# EAGLE design VisualightMicroBulb_041 (EAGLE 6.2)
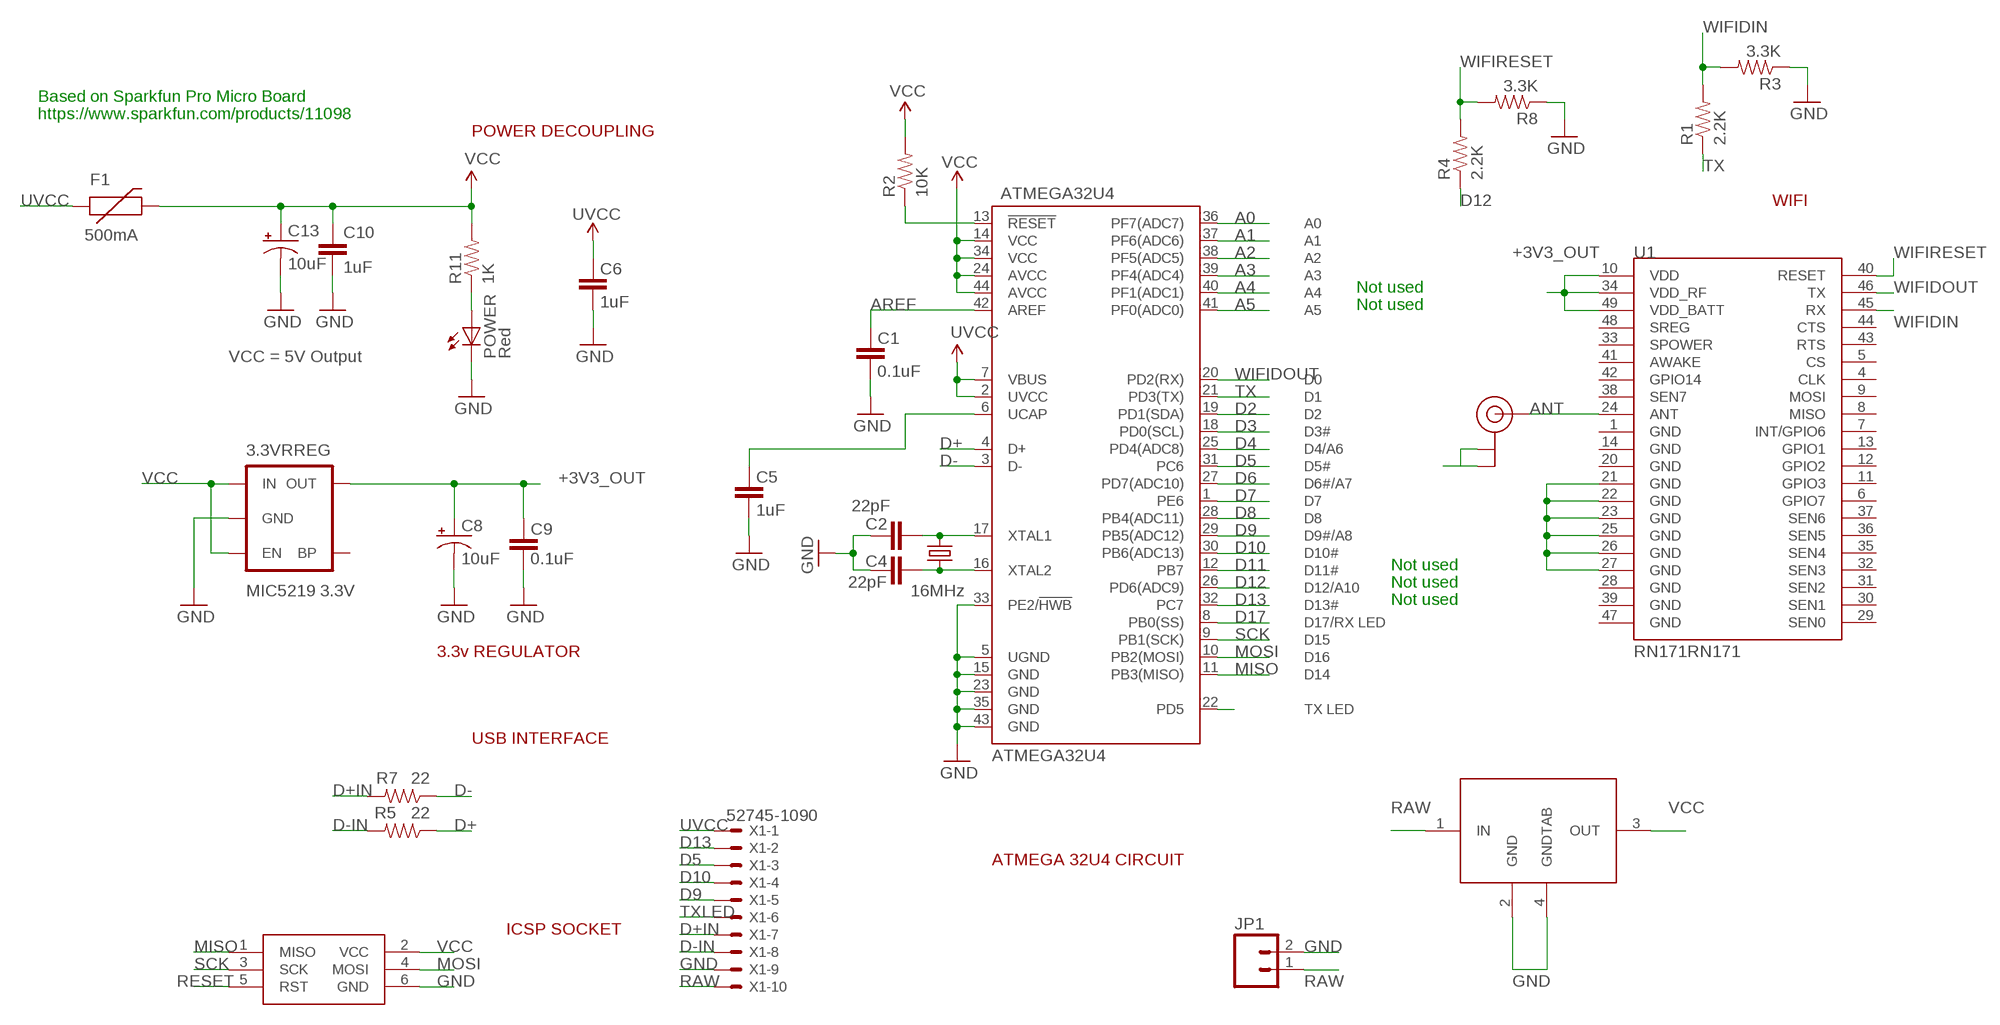
[diagram p0: schematic, sheet 1]

## Parts
3.3VRREG  MIC5219 3.3V  V_REG_MIC52193.3V  [SOT23-5]
ATMEGA32U4  ATMEGA32U4  ATMEGA32U4TQFP  [SPARKFUN-DIGITALIC_TQFP44]
C1  0.1uF  CAP0402-CAP  [0402-CAP]
C2  22pF  CAP0402-CAP  [0402-CAP]
C4  22pF  CAP0402-CAP  [0402-CAP]
C5  1uF  CAP0402-CAP  [0402-CAP]
C6  1uF  CAP0402-CAP  [0402-CAP]
C8  10uF  CAP_POL1206  [EIA3216]
C9  0.1uF  CAP0402-CAP  [0402-CAP]
C10  1uF  CAP0402-CAP  [0402-CAP]
C13  10uF  CAP_POL1206  [EIA3216]
F1  500mA  PTCSMD  [PTC-1206]
ISP1  AVRISP-6  [AVRISP]
JP1  M02PTH  [1X02]
POWER  Red  LED0603  [LED-0603]
R1  2.2K  RESISTOR0402-RES  [0402-RES]
R2  10K  RESISTOR0402-RES  [0402-RES]
R3  3.3K  RESISTOR0402-RES  [0402-RES]
R4  2.2K  RESISTOR0402-RES  [0402-RES]
R5  22  RESISTOR0402-RES  [0402-RES]
R7  22  RESISTOR0402-RES  [0402-RES]
R8  3.3K  RESISTOR0402-RES  [0402-RES]
R11  1K  RESISTOR0402-RES  [0402-RES]
U1  RN171RN171  [RN171]
U$1  U.FL  [U.FL]
U$2  MIC5239  [SOT223]
X1  52745-1090  [52745-1090]
Y1  16MHz  CRYSTAL5X3  [CRYSTAL-SMD-5X3]

## Nets
+3V3_OUT: 3.3VRREG.5(OUT) C8.A(+) C9.2 U1.10(VDD) U1.34(VDD_RF) U1.49(VDD_BATT)
A0: ATMEGA32U4.36(PF7(ADC7))
A1: ATMEGA32U4.37(PF6(ADC6))
A2: ATMEGA32U4.38(PF5(ADC5))
A3: ATMEGA32U4.39(PF4(ADC4))
A4: ATMEGA32U4.40(PF1(ADC1))
A5: ATMEGA32U4.41(PF0(ADC0))
ANT: U1.24(ANT) U$1.P$3(SIGNAL)
AREF: ATMEGA32U4.42(AREF) C1.2
D2: ATMEGA32U4.19(PD1(SDA))
D3: ATMEGA32U4.18(PD0(SCL))
D4: ATMEGA32U4.25(PD4(ADC8))
D5: ATMEGA32U4.31(PC6) X1.3
D6: ATMEGA32U4.27(PD7(ADC10))
D7: ATMEGA32U4.1(PE6)
D8: ATMEGA32U4.28(PB4(ADC11))
D9: ATMEGA32U4.29(PB5(ADC12)) X1.5
D10: ATMEGA32U4.30(PB6(ADC13)) X1.4
D11: ATMEGA32U4.12(PB7)
D12: ATMEGA32U4.26(PD6(ADC9)) R4.1
D13: ATMEGA32U4.32(PC7) X1.2
D17: ATMEGA32U4.8(PB0(SS))
D+: ATMEGA32U4.4(D+) R5.1
D+IN: R7.2 X1.7
D-: ATMEGA32U4.3(D-) R7.1
D-IN: R5.2 X1.8
GND [vcc]: 3.3VRREG.2(GND) ATMEGA32U4.5(UGND) ATMEGA32U4.15(GND) ATMEGA32U4.23(GND) ATMEGA32U4.33(PE2/!HWB) ATMEGA32U4.35(GND) ATMEGA32U4.43(GND) C1.1 C2.2 C4.2 C5.1 C6.1 C8.C(-) C9.1 C10.2 C13.C(-) ISP1.6(GND) JP1.2 POWER.C R3.1 R8.1 U1.21(GND) U1.22(GND) U1.23(GND) U1.25(GND) U1.26(GND) U1.27(GND) U$1.P$1(GND) U$1.P$2(GND) U$2.2(GND) U$2.4(GNDTAB) X1.9
MISO: ATMEGA32U4.11(PB3(MISO)) ISP1.1(MISO)
MOSI: ATMEGA32U4.10(PB2(MOSI)) ISP1.4(MOSI)
N$1: ATMEGA32U4.16(XTAL2) C4.1 Y1.1
N$2: ATMEGA32U4.17(XTAL1) C2.1 Y1.3
N$4: ATMEGA32U4.6(UCAP) C5.2
N$38: POWER.A R11.1
RAW: JP1.1 U$2.1(IN) X1.10
RESET: ATMEGA32U4.13(!RESET) ISP1.5(RST) R2.1
SCK: ATMEGA32U4.9(PB1(SCK)) ISP1.3(SCK)
TX: ATMEGA32U4.21(PD3(TX)) R1.1
TXLED: ATMEGA32U4.22(PD5) X1.6
UVCC: ATMEGA32U4.2(UVCC) ATMEGA32U4.7(VBUS) C6.2 F1.1 X1.1
VCC: 3.3VRREG.1(IN) 3.3VRREG.3(EN) ATMEGA32U4.14(VCC) ATMEGA32U4.24(AVCC) ATMEGA32U4.34(VCC) ATMEGA32U4.44(AVCC) C10.1 C13.A(+) F1.2 ISP1.2(VCC) R2.2 R11.2 U$2.3(OUT)
WIFIDIN: R1.2 R3.2 U1.45(RX)
WIFIDOUT: ATMEGA32U4.20(PD2(RX)) U1.46(TX)
WIFIRESET: R4.2 R8.2 U1.40(RESET)
Unconnected: 3.3VRREG.4(BP) U1.1(GND) U1.4(CLK) U1.5(CS) U1.6(GPIO7) U1.7(INT/GPIO6) U1.8(MISO) U1.9(MOSI) U1.11(GPIO3) U1.12(GPIO2) U1.13(GPIO1) U1.14(GND) U1.20(GND) U1.28(GND) U1.29(SEN0) U1.30(SEN1) U1.31(SEN2) U1.32(SEN3) U1.33(SPOWER) U1.35(SEN4) U1.36(SEN5) U1.37(SEN6) U1.38(SEN7) U1.39(GND) U1.41(AWAKE) U1.42(GPIO14) U1.43(RTS) U1.44(CTS) U1.47(GND) U1.48(SREG)

## Notes on the sheet
- Based on Sparkfun Pro Micro Board
- https://www.sparkfun.com/products/11098
- POWER DECOUPLING
- WIFI
- Not used
- Not used
- VCC = 5V Output
- Not used
- Not used
- Not used
- 3.3v REGULATOR
- USB INTERFACE
- ATMEGA 32U4 CIRCUIT
- ICSP SOCKET

## Library data of the parts
3.3VRREG = SparkFun-PowerIC:V_REG_MIC5219: V_REG MIC5219 Standard 500mA LDO voltage regulator in SOT-23 layout. Micrel part MIC5219. BP (by-pass) pin is used to lower output noise with 470pF cap, may be left open.; PROD_ID: VREG-09872
ATMEGA32U4 = SparkFun-DigitalIC:ATMEGA32U4: Atmel 44-pin 8-bit Microcontroller with 32KBytes of ISP Flash and USB Controller
C1 C2 C4-C6 C9 C10 = SparkFun:CAP: Capacitor Standard 0603 ceramic capacitor, and 0.1" leaded capacitor.
C8 C13 = SparkFun:CAP_POL: Capacitor Polarized These are standard SMD and PTH capacitors. Normally 10uF, 47uF, and 100uF in electrolytic and tantalum varieties. Always verify the external diameter of the through hole cap, it varies with capacity, voltage, and manufacturer. The EIA devices should be standard.
F1 = SparkFun:PTC: Resettable Fuse PTC Resettable Fuse. Spark Fun Electronics SKU : COM-08357
ISP1 = adafruit:AVRISP: AVR ISP HEADER Standard 6 pin header for AVR programming
JP1 = SparkFun-Connectors:M02: Header 2 Standard 2-pin 0.1" header. Use with straight break away headers (SKU : PRT-00116), right angle break away headers (PRT-00553), swiss pins (PRT-00743), machine pins (PRT-00117), and female headers (PRT-00115). Molex polarized connector foot print use with SKU : PRT-08233 with associated crimp pins and housings.
POWER = SparkFun:LED: LEDs Standard schematic elements and footprints for 5mm, 3mm, 1206, and 0603 sized LEDs. 5mm - Spark Fun Electronics SKU : COM-00529 (and others)
R1-R5 R7 R8 R11 = SparkFun:RESISTOR: Resistor Basic schematic elements and footprints for 0603, 1206, and PTH resistors.
U1 = SparkFun-RF:RN171: WiFi Module
U$1 = SparkFun-Connectors:U.FL: SMD antenna connector- WRL-09144
U$2 = v-reg:MIC5239
X1 = con-molex:52745-1090: FFC/FPC-to-Board 0.50mm (.020") SMT Top Contact Right Angle, ZIF, Style Receptacle 52745 / 52435 Source: http://www.molex.com/product/ffc/52745.html; MPN: 52745-1090; OC_FARNELL: unknown; OC_NEWARK: 92M6380
Y1 = SparkFun:CRYSTAL: Crystals Various standard crystals. Proven footprints. Spark Fun Electronics SKU : COM-00534

## Net classes
0 default: width 0.003 mm, drill 0.381 mm, clearance 0.152 mm

## Board
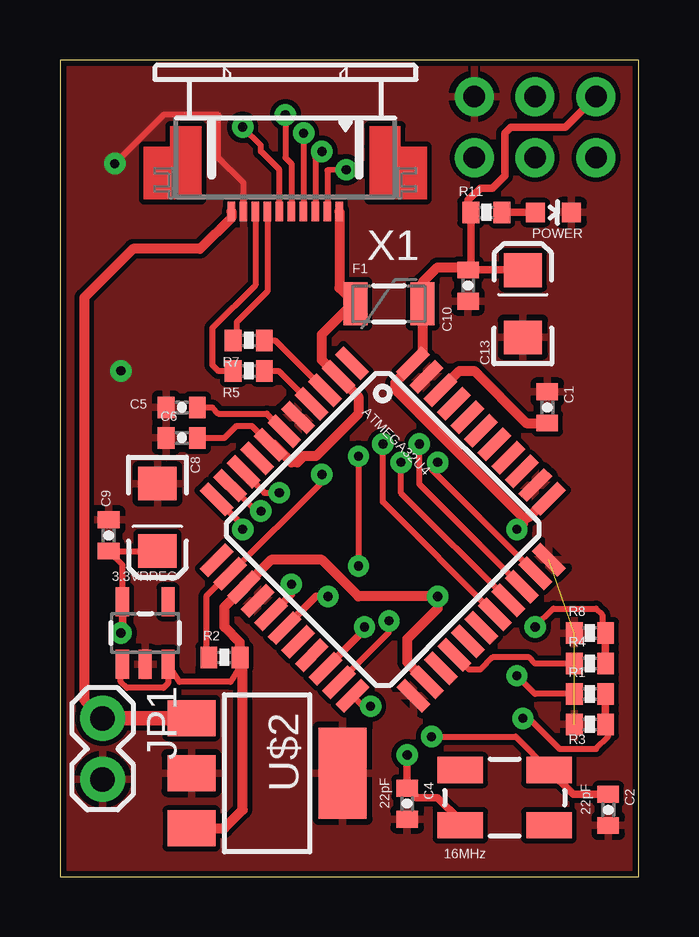
[diagram p1: board, top side]
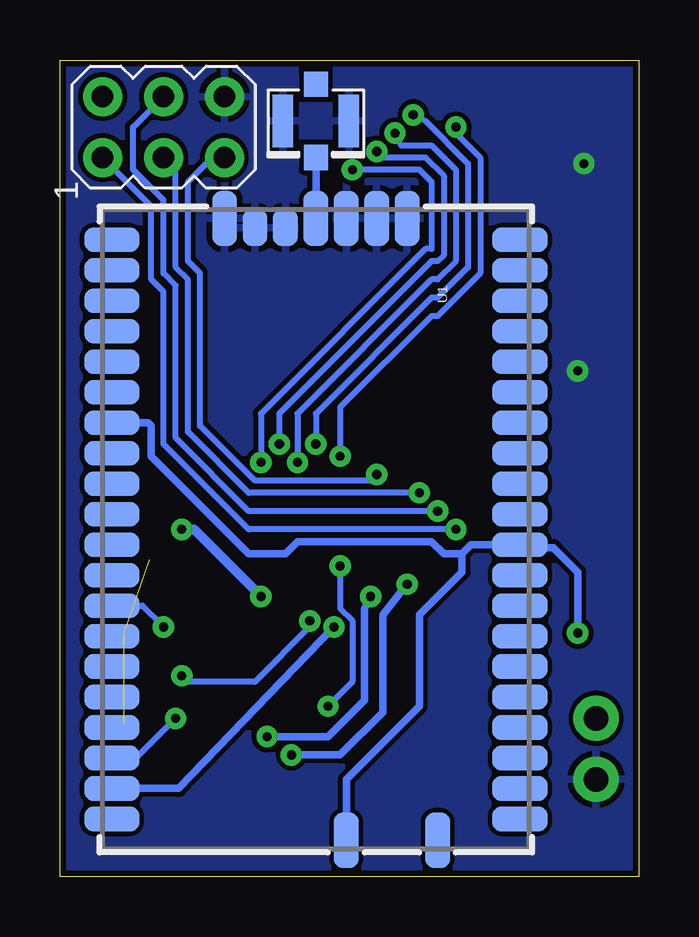
[diagram p2: board, bottom side, seen from below]

Size 24.13 x 34.04 mm. Coordinates in mm from the lower left corner, seen from the top.
Outline: 0,34.04 0,0 24.13,0 24.13,34.04 0,34.04
Copper layers (1*16): Top 0.035mm / dielectric 1.5mm / Bottom 0.035mm
Design rules: minimum track width 8mil, minimum drill 15mil, track to track 8mil, track to pad 8mil, pad to pad 8mil, via to via 8mil, smd to smd 8mil, copper to edge 10mil, drill to drill 8mil, minimum pad ring 12mil, minimum via ring 10mil, stop-mask expansion 4mil, vias tented up to drill 25mil, thermal gap 10mil

### Footprints (pad centres in the part's own frame; a part is rotated, then mirrored left to right if it is on the bottom)
SOT23-5 = smd 0.55 x 1.2: 1 -0.95,-1.3; 2 0,-1.3; 3 0.95,-1.3; 4 0.95,1.3; 5 -0.95,1.3
SPARKFUN-DIGITALIC_TQFP44 = smd 1.5 x 0.5: 1 -5.8,4; 2 -5.8,3.2; 3 -5.8,2.4; 4 -5.8,1.6; 5 -5.8,0.8; 6 -5.8,0; 7 -5.8,-0.8; 8 -5.8,-1.6; 9 -5.8,-2.4; 10 -5.8,-3.2; 11 -5.8,-4; 23 5.8,-4; 24 5.8,-3.2; 25 5.8,-2.4; 26 5.8,-1.6; 27 5.8,-0.8; 28 5.8,0; 29 5.8,0.8; 30 5.8,1.6; 31 5.8,2.4; 32 5.8,3.2; 33 5.8,4 | smd 0.5 x 1.5: 12 -4,-5.8; 13 -3.2,-5.8; 14 -2.4,-5.8; 15 -1.6,-5.8; 16 -0.8,-5.8; 17 0,-5.8; 18 0.8,-5.8; 19 1.6,-5.8; 20 2.4,-5.8; 21 3.2,-5.8; 22 4,-5.8; 34 4,5.8; 35 3.2,5.8; 36 2.4,5.8; 37 1.6,5.8; 38 0.8,5.8; 39 0,5.8; 40 -0.8,5.8; 41 -1.6,5.8; 42 -2.4,5.8; 43 -3.2,5.8; 44 -4,5.8
0402-CAP = smd 0.7 x 0.9: 1 -0.65,0; 2 0.65,0
EIA3216 = smd 1.4 x 1.6: A 1.4,0; C -1.4,0
PTC-1206 = smd 1 x 1.8: 1 -1.4,0; 2 1.4,0
AVRISP = drill 0.9 pad 1.626: 1 -1.27,2.54; 2 1.27,2.54; 3 -1.27,0; 4 1.27,0; 5 -1.27,-2.54; 6 1.27,-2.54
1X02 = drill 1.016 pad 1.88: 1 0,0; 2 2.54,0
LED-0603 = smd 0.8 x 0.8: A 0,-0.75; C 0,0.75
0402-RES = smd 0.7 x 0.9: 1 -0.65,0; 2 0.65,0
RN171 = smd 1.016 x 2.286: 1 12.065,8.509; 2 10.795,8.509; 3 9.525,8.509; 4 8.255,8.509; 5 6.985,8.509; 6 5.715,8.509; 7 4.445,8.509; 8 3.175,8.509; 9 1.905,8.509; 10 0.635,8.509; 11 -0.635,8.509; 12 -1.905,8.509; 13 -3.175,8.509; 14 -4.445,8.509; 15 -5.715,8.509; 16 -6.985,8.509; 17 -8.255,8.509; 18 -9.525,8.509; 19 -10.795,8.509; 20 -12.065,8.509; 28 -12.065,-8.509; 29 -10.795,-8.509; 30 -9.525,-8.509; 31 -8.255,-8.509; 32 -6.985,-8.509; 33 -5.715,-8.509; 34 -4.445,-8.509; 35 -3.175,-8.509; 36 -1.905,-8.509; 37 -0.635,-8.509; 38 0.635,-8.509; 39 1.905,-8.509; 40 3.175,-8.509; 41 4.445,-8.509; 42 5.715,-8.509; 43 6.985,-8.509; 44 8.255,-8.509; 45 9.525,-8.509; 46 10.795,-8.509; 47 12.065,-8.509 | smd 2.286 x 1.016: 21 -12.954,3.81; 22 -12.954,2.54; 23 -12.954,1.27; 24 -12.954,0; 27 -12.954,-3.81; 48 12.954,5.08; 49 12.954,1.27 | smd 1.524 x 1.016: 25 -12.573,-1.27; 26 -12.573,-2.54
U.FL = smd 2.2 x 0.85: P$1 0,1.375; P$2 0,-1.375 | smd 1.05 x 1: P$3 1.525,0; P$4 -1.525,0
SOT223 = smd 1.5 x 2: 1 -2.3,-3.15; 2 0,-3.15; 3 2.3,-3.15 | smd 3.8 x 2: 4 0,3.15
52745-1090 = smd 0.3 x 0.8: 1 -2.25,2.5; 2 -1.75,2.5; 3 -1.25,2.5; 4 -0.75,2.5; 5 -0.25,2.5; 6 0.25,2.5; 7 0.75,2.5; 8 1.25,2.5; 9 1.75,2.5; 10 2.25,2.5
CRYSTAL-SMD-5X3 = smd 1.9 x 1.1: 1 -1.85,-1.15; 2 1.85,-1.15; 3 1.85,1.15; 4 -1.85,1.15

### Placement (x,y rotation side)
3.3VRREG  3.56,10.16 0 top
ATMEGA32U4  13.46,14.48 315.1 top
C1  20.32,19.56 270 top
C2  22.86,2.79 270 top
C4  14.48,3.05 270 top
C5  5.08,19.56 0 top
C6  5.08,18.29 0 top
C8  4.06,14.99 270 top
C9  2.03,14.22 270 top
C10  17.02,24.64 270 top
C13  19.3,23.88 90 top
F1  13.72,23.88 0 top
ISP1  19.81,31.24 90 bottom
JP1  1.78,6.6 270 top
POWER  20.57,27.69 270 top
R1  22.1,7.62 0 top
R2  6.86,9.14 0 top
R3  22.1,6.35 0 top
R4  22.1,8.89 0 top
R5  7.87,21.08 180 top
R7  7.87,22.35 180 top
R8  22.1,10.16 0 top
R11  17.78,27.69 180 top
U1  13.46,14.48 270 bottom
U$1  13.46,31.5 270 bottom
U$2  8.64,4.32 270 top
X1  9.4,30.23 180 top
Y1  18.54,3.3 0 top

### Tracks (layer width: path | path; a pad name or v marks a point on that pad's centre or on a via)
+3V3_OUT  (via drill 0.38)
  Top 0.254: 3.3VRREG.5 2.61,13 C9.2 4.05,13.57 C8.A
  Top 0.305: 3.3VRREG.5 2.61,10.23 v2.54,10.16
  Bottom 0.305: v2.54,10.16 2.54,12.7 3.56,13.72 4.83,13.72 U1.10 6.98,13.84 7.37,13.46 | 7.37,13.46 8.13,13.46 8.64,13.97 14.22,13.97 14.73,13.46 16.26,13.46 20.32,17.53 20.32,18.8 20.45,18.92 U1.34 | U1.49 12.19,4.06 9.14,7.11 9.14,10.92 7.37,12.7 7.37,13.46
ANT
  Bottom 0.305: U1.24 U$1.P$3
AREF
  Top 0.406: ATMEGA32U4.42 16.66,21.08 17.27,21.08 19.45,18.91 C1.2
D2
  Top 0.406: ATMEGA32U4.19
D5  (via drill 0.38)
  Top 0.254: ATMEGA32U4.31 14.99,16.36 v14.99,18.03 | v10.92,30.23 10.65,29.95 X1.3
  Bottom 0.254: v10.92,30.23 10.67,29.97 8.89,29.97 8.13,29.21 8.13,25.91 8.38,25.65 8.64,25.65 14.99,19.3 v14.99,18.03
D9  (via drill 0.38)
  Top 0.254: ATMEGA32U4.29 13.46,15.62 v13.46,18.03 | v9.4,31.75 9.4,29.97 9.65,29.72 X1.5
  Bottom 0.254: v9.4,31.75 8.89,31.5 7.11,29.72 7.11,25.4 8.38,24.13 8.64,24.13 13.46,19.3 v13.46,18.03
D10  (via drill 0.38)
  Top 0.254: ATMEGA32U4.30 14.22,15.99 v14.22,17.27 | v10.16,30.99 10.15,30.72 X1.4
  Bottom 0.254: v10.16,30.99 9.91,30.48 8.64,30.48 7.62,29.46 7.62,25.65 8.38,24.89 8.64,24.89 14.22,19.3 v14.22,17.27
D12
  Top 0.254: R4.1 19.81,8.89 19.56,9.14 18.03,9.14 17.53,8.64 17.06,8.64 ATMEGA32U4.26
D13  (via drill 0.38)
  Top 0.254: ATMEGA32U4.32 15.49,16.99 15.49,17.27 v15.75,17.27 | v11.94,29.46 11.15,29.44 X1.2
  Bottom 0.254: v11.94,29.46 9.14,29.46 8.64,28.96 8.64,26.16 8.89,26.16 15.75,19.3 v15.75,17.27
D+
  Top 0.254: R5.1 9.11,21.08 ATMEGA32U4.4
D+IN
  Top 0.254: X1.7 8.65,24.4 7.37,23.11 7.37,22.49 R7.2
D-
  Top 0.254: R7.1 8.97,22.35 ATMEGA32U4.3
D-IN
  Top 0.254: X1.8 8.15,24.66 6.35,22.86 6.35,21.34 6.6,21.08 R5.2
GND  (via drill 0.38)  (2 unrouted)
  Top 0.254: X1.9 7.65,28.93 6.6,29.97 6.6,31.75 4.32,31.75 v2.29,29.72
  other vias: 2.54,21.08
  pour Bottom: 24.13,0 0,0 0,34.04 24.13,34.04
  pour Top: 24.13,0 0,0 0,34.04 24.13,34.04
MISO  (via drill 0.38 pad 0.25)
  Top 0.254: ATMEGA32U4.11 7.37,14.9 v7.62,14.48
  Bottom 0.254: ISP1.1 20.32,27.94 20.32,24.89 19.81,24.38 19.81,18.03 16.26,14.48 v7.62,14.48
MOSI  (via drill 0.38 pad 0.25)
  Top 0.254: ATMEGA32U4.10 8.13,15.27 v8.38,15.24
  Bottom 0.254: v8.38,15.24 16.26,15.24 19.3,18.29 19.3,24.64 19.81,25.15 19.81,28.19 21.08,29.46 21.08,31.24 ISP1.4
N$1  (via drill 0.38)
  Top 0.305: ATMEGA32U4.16 9.65,11.79 v9.65,12.19 | v14.48,5.08 C4.1 14.87,3.3 15.75,3.3 16.69,2.36 Y1.1
  Bottom 0.305: v9.65,12.19 10.67,10.92 10.67,6.86 12.45,5.08 v14.48,5.08
N$2  (via drill 0.38)
  Top 0.254: v15.49,5.84 19,5.84 Y1.3
  Top 0.305: ATMEGA32U4.17 10.68,11.68 v11.18,11.68 | Y1.3 21.4,3.44 C2.1
  Bottom 0.305: v11.18,11.68 11.43,11.18 11.43,7.37 12.95,5.84 v15.49,5.84
N$4
  Top 0.254: C5.2 6.35,19.56 6.6,19.3 8.62,19.3 ATMEGA32U4.6
N$38
  Top 0.305: R11.1 POWER.A
RAW
  Top 0.406: X1.10 7.15,27.47 5.84,26.16 3.05,26.16 1.02,24.13 1.02,7.37 JP1.1
  Top 0.61: JP1.1 5.47,6.6 U$2.1
RESET  (via drill 0.38 pad 0.25)
  Top 0.254: v10.92,16.76 10.92,16.45 ATMEGA32U4.13 7.04,12.63 6.1,11.68 6.1,9.26 R2.1
  Bottom 0.254: v10.92,16.76 11.18,16.51 16,16.51 18.29,18.8 18.29,25.15 18.8,25.65 18.8,28.96 17.78,29.97 ISP1.5
SCK  (via drill 0.38 pad 0.64)
  Top 0.254: ATMEGA32U4.9 8.53,16 v9.14,16
  Bottom 0.254: v9.14,16 16.26,16 18.8,18.54 18.8,24.89 19.3,25.4 19.3,29.46 ISP1.3
TX  (via drill 0.38)
  Top 0.254: ATMEGA32U4.21 13.72,10.19 v13.72,10.67 | R1.1 19.81,7.62 v19.05,8.38
  Bottom 0.254: v13.72,10.67 13.72,10.41 16,8.13 18.8,8.13 v19.05,8.38
TXLED  (via drill 0.38)
  Top 0.254: X1.6 9.15,29.46 8.38,30.23 8.38,30.48 v7.62,31.24 | v12.45,17.53 v12.45,12.95 | v12.95,7.11 12.63,7.11 ATMEGA32U4.22
  Bottom 0.254: v12.45,12.95 12.45,11.18 11.94,10.67 11.94,8.13 v12.95,7.11 | v7.62,31.24 7.62,30.99 6.6,29.97 6.6,25.15 8.38,23.37 8.64,23.37 12.45,19.56 v12.45,17.53
UVCC
  Top 0.254: C6.2 6.86,18.29 7.37,18.8 8,18.8 ATMEGA32U4.7
  Top 0.406: ATMEGA32U4.7 8.92,18.01 9.65,17.27 9.91,17.27 10.16,17.53 10.67,17.53 12.45,19.3 12.45,20.01 ATMEGA32U4.2 10.92,21.53 10.92,22.61 12.19,23.88 F1.1 11.65,24.54 X1.1
VCC  (via drill 0.38)
  Top 0.254: R2.2 7.51,8.78 7.11,8.13 4.98,8.13 3.3VRREG.3 4.51,8.06 4.32,7.87 2.79,7.87 2.54,8.13 2.54,8.79 3.3VRREG.1 | 14.22,20.83 14.22,20.91 ATMEGA32U4.44
  Top 0.305: ISP1.2 21.08,31.24 18.8,31.24 18.54,30.99 18.54,29.21 18.03,28.7 17.53,28.7 17.02,28.19 17.02,27.8 R11.2 17.13,25.4 C10.1 19.29,25.29 C13.A
  Top 0.406: 14.72,21.33 ATMEGA32U4.44 15.12,21.8 F1.2 15.12,24.77 15.75,25.4 16.91,25.4 C10.1 | 19.3,14.99 13.97,20.32 13.97,20.57 14.22,20.83 | 19.3,14.99 19.56,14.99 20.34,15.76 ATMEGA32U4.34 | 7.75,12.06 ATMEGA32U4.14 | U$2.3 6.84,2.02 7.62,2.79 7.62,9.03 R2.2 7.51,9.76 6.86,10.41 6.86,11.25 ATMEGA32U4.14 | 19.3,14.99 19.3,14.73 v19.05,14.48 | ATMEGA32U4.24 14.48,8.95 14.48,9.91 15.75,11.18 v15.75,11.68 12.45,11.68 10.92,13.21 8.81,13.21 ATMEGA32U4.14
  Bottom 0.406: v19.05,14.48 18.54,14.48 v15.75,11.68
WIFIDIN  (via drill 0.38)
  Top 0.254: v19.3,6.6 19.56,6.6 20.83,5.33 22.35,5.33 22.86,5.84 22.86,6.24 R3.2
  Top 0.305: R3.2 R1.2
  Bottom 0.254: U1.45 20.95,4.95 v19.3,6.6
WIFIDOUT  (via drill 0.38)
  Top 0.305: ATMEGA32U4.20 12.55,10.16 v12.7,10.41
  Bottom 0.305: v12.7,10.41 19.18,3.68 U1.46
WIFIRESET  (via drill 0.38)
  Top 0.254: v19.81,10.41 20.57,11.18 22.35,11.18 22.61,10.92 22.61,10.3 R8.2
  Top 0.305: R4.2 R8.2
  Bottom 0.254: U1.40 20.7,11.3 v19.81,10.41